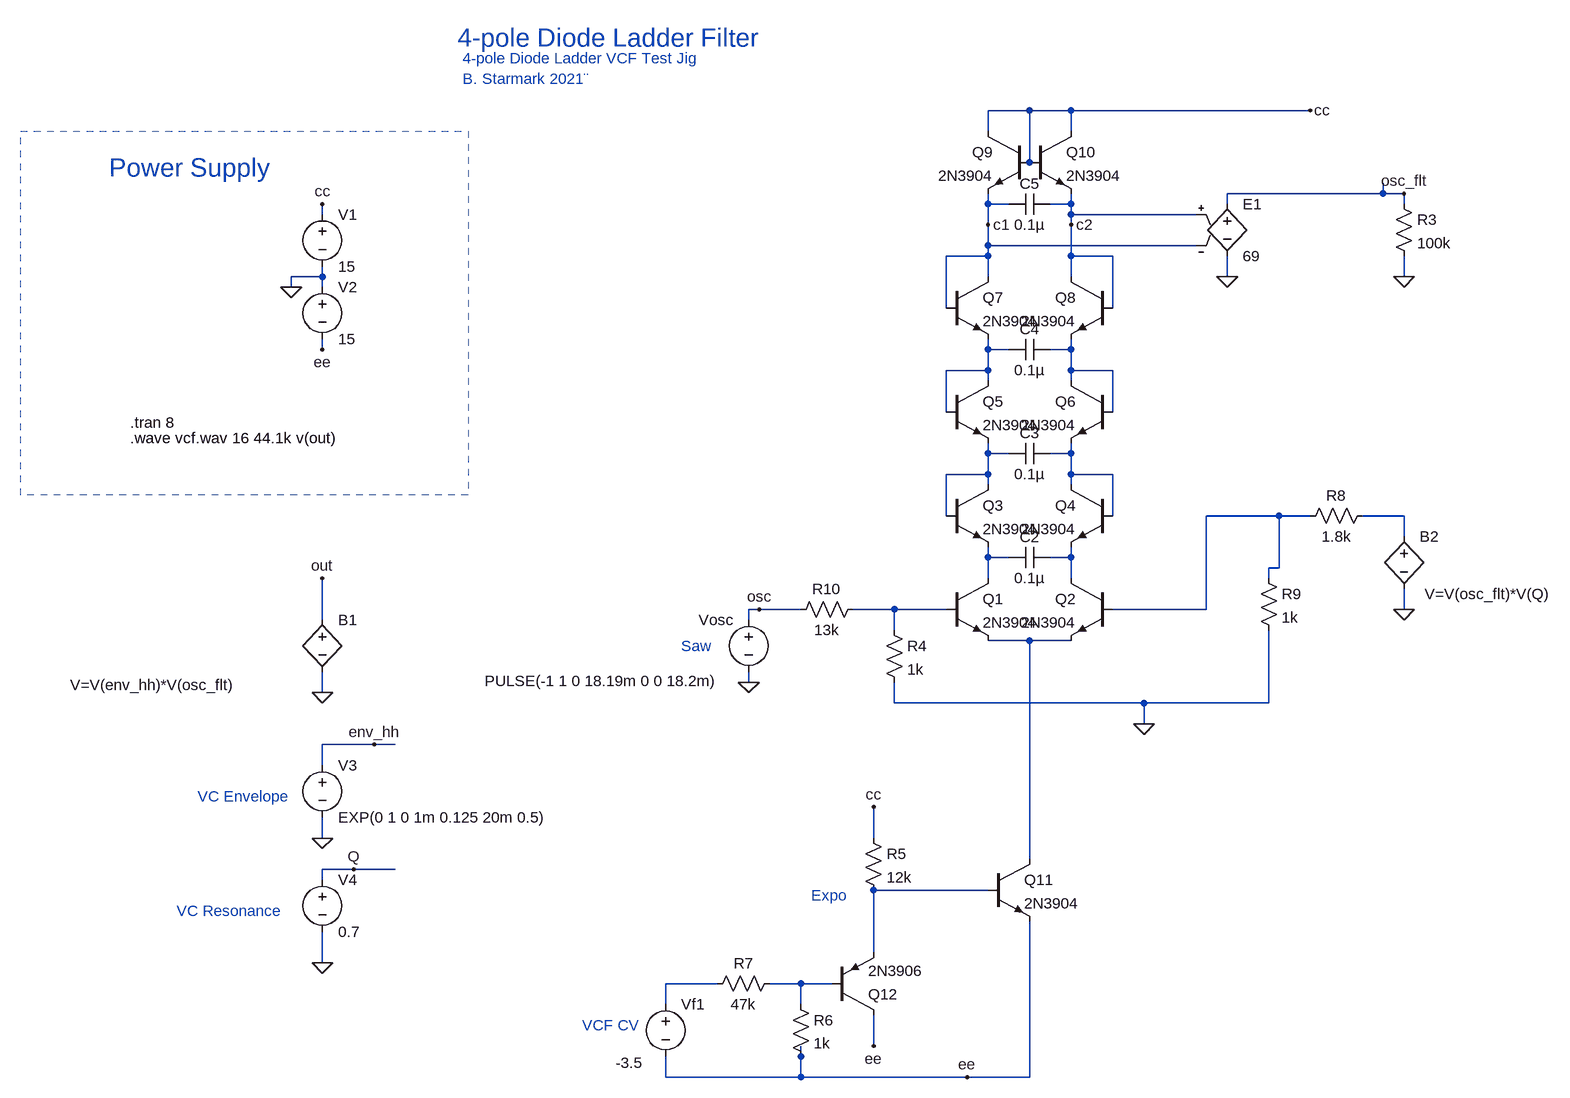
[diagram p0: schematic vcf.asc]
vcf.asc, the LTspice schematic file:
Version 4
SHEET 1 2688 1252
WIRE 1792 -352 1728 -352
WIRE 1856 -352 1792 -352
WIRE 2224 -352 1856 -352
WIRE 1728 -320 1728 -352
WIRE 1856 -320 1856 -352
WIRE 1792 -272 1792 -352
WIRE 2336 -224 2336 -240
WIRE 2336 -224 2096 -224
WIRE 2368 -224 2336 -224
WIRE 1728 -208 1728 -224
WIRE 1760 -208 1728 -208
WIRE 1856 -208 1856 -224
WIRE 1856 -208 1824 -208
WIRE 2096 -208 2096 -224
WIRE 2368 -208 2368 -224
WIRE 704 -192 704 -208
WIRE 1856 -192 1856 -208
WIRE 2048 -192 1856 -192
WIRE 1728 -176 1728 -208
WIRE 1856 -176 1856 -192
WIRE 1728 -144 1728 -176
WIRE 2048 -144 1728 -144
WIRE 1728 -128 1728 -144
WIRE 1728 -128 1664 -128
WIRE 1856 -128 1856 -176
WIRE 1920 -128 1856 -128
WIRE 704 -96 704 -112
WIRE 704 -96 656 -96
WIRE 1728 -96 1728 -128
WIRE 1856 -96 1856 -128
WIRE 2096 -96 2096 -128
WIRE 2368 -96 2368 -128
WIRE 656 -80 656 -96
WIRE 704 -80 704 -96
WIRE 1664 -48 1664 -128
WIRE 1920 -48 1920 -128
WIRE 704 16 704 0
WIRE 1728 16 1728 0
WIRE 1760 16 1728 16
WIRE 1856 16 1856 0
WIRE 1856 16 1824 16
WIRE 1728 48 1728 16
WIRE 1728 48 1664 48
WIRE 1856 48 1856 16
WIRE 1920 48 1856 48
WIRE 1728 64 1728 48
WIRE 1856 64 1856 48
WIRE 1664 112 1664 48
WIRE 1920 112 1920 48
WIRE 1728 176 1728 160
WIRE 1760 176 1728 176
WIRE 1856 176 1856 160
WIRE 1856 176 1824 176
WIRE 1728 208 1728 176
WIRE 1728 208 1664 208
WIRE 1856 208 1856 176
WIRE 1920 208 1856 208
WIRE 1728 224 1728 208
WIRE 1856 224 1856 208
WIRE 1664 272 1664 208
WIRE 1920 272 1920 208
WIRE 2176 272 2064 272
WIRE 2224 272 2176 272
WIRE 2368 272 2304 272
WIRE 2368 304 2368 272
WIRE 1728 336 1728 320
WIRE 1760 336 1728 336
WIRE 1856 336 1856 320
WIRE 1856 336 1824 336
WIRE 2176 352 2176 272
WIRE 2176 352 2160 352
WIRE 1728 368 1728 336
WIRE 1856 368 1856 336
WIRE 2160 368 2160 352
WIRE 1376 416 1360 416
WIRE 1440 416 1376 416
WIRE 1584 416 1520 416
WIRE 1664 416 1584 416
WIRE 2064 416 2064 272
WIRE 2064 416 1920 416
WIRE 2368 416 2368 384
WIRE 704 432 704 368
WIRE 1360 432 1360 416
WIRE 1584 448 1584 416
WIRE 1792 464 1728 464
WIRE 1856 464 1792 464
WIRE 1360 528 1360 512
WIRE 704 544 704 512
WIRE 1584 560 1584 528
WIRE 1968 560 1584 560
WIRE 2160 560 2160 448
WIRE 2160 560 1968 560
WIRE 1968 592 1968 560
WIRE 784 624 704 624
WIRE 816 624 784 624
WIRE 704 656 704 624
WIRE 704 768 704 736
WIRE 1552 768 1552 720
WIRE 1792 800 1792 464
WIRE 752 816 704 816
WIRE 816 816 752 816
WIRE 704 832 704 816
WIRE 1728 848 1552 848
WIRE 1552 944 1552 848
WIRE 704 960 704 912
WIRE 1312 992 1232 992
WIRE 1440 992 1392 992
WIRE 1488 992 1440 992
WIRE 1232 1024 1232 992
WIRE 1440 1024 1440 992
WIRE 1552 1088 1552 1040
WIRE 1440 1104 1440 1088
WIRE 1232 1136 1232 1104
WIRE 1440 1136 1440 1104
WIRE 1440 1136 1232 1136
WIRE 1696 1136 1440 1136
WIRE 1792 1136 1792 896
WIRE 1792 1136 1696 1136
FLAG 656 -80 0
FLAG 704 16 ee
FLAG 704 -208 cc
FLAG 704 368 out
FLAG 704 544 0
FLAG 2224 -352 cc
FLAG 2368 -96 0
FLAG 2096 -96 0
FLAG 1728 -176 c1
FLAG 1856 -176 c2
FLAG 1552 720 cc
FLAG 1552 1088 ee
FLAG 1696 1136 ee
FLAG 2368 -224 osc_flt
FLAG 1360 528 0
FLAG 704 768 0
FLAG 784 624 env_hh
FLAG 1376 416 osc
FLAG 1968 592 0
FLAG 2368 416 0
FLAG 704 960 0
FLAG 752 816 Q
SYMBOL voltage 704 -208 R0
SYMATTR InstName V1
SYMATTR Value 15
SYMBOL voltage 704 -96 R0
SYMATTR InstName V2
SYMATTR Value 15
SYMBOL bv 704 416 R0
WINDOW 3 -388 116 Left 2
SYMATTR Value V=V(env_hh)*V(osc_flt)
SYMATTR InstName B1
SYMBOL npn 1664 368 R0
SYMATTR InstName Q1
SYMATTR Value 2N3904
SYMBOL npn 1920 368 M0
SYMATTR InstName Q2
SYMATTR Value 2N3904
SYMBOL cap 1824 320 R90
WINDOW 0 0 32 VBottom 2
WINDOW 3 32 32 VTop 2
SYMATTR InstName C2
SYMATTR Value 0.1µ
SYMBOL npn 1664 224 R0
SYMATTR InstName Q3
SYMATTR Value 2N3904
SYMBOL npn 1920 224 M0
SYMATTR InstName Q4
SYMATTR Value 2N3904
SYMBOL cap 1824 160 R90
WINDOW 0 0 32 VBottom 2
WINDOW 3 32 32 VTop 2
SYMATTR InstName C3
SYMATTR Value 0.1µ
SYMBOL npn 1664 64 R0
SYMATTR InstName Q5
SYMATTR Value 2N3904
SYMBOL npn 1920 64 M0
SYMATTR InstName Q6
SYMATTR Value 2N3904
SYMBOL cap 1824 0 R90
WINDOW 0 0 32 VBottom 2
WINDOW 3 32 32 VTop 2
SYMATTR InstName C4
SYMATTR Value 0.1µ
SYMBOL npn 1664 -96 R0
SYMATTR InstName Q7
SYMATTR Value 2N3904
SYMBOL npn 1920 -96 M0
SYMATTR InstName Q8
SYMATTR Value 2N3904
SYMBOL cap 1824 -224 R90
WINDOW 0 0 32 VBottom 2
WINDOW 3 32 32 VTop 2
SYMATTR InstName C5
SYMATTR Value 0.1µ
SYMBOL npn 1792 -320 M0
SYMATTR InstName Q9
SYMATTR Value 2N3904
SYMBOL npn 1792 -320 R0
SYMATTR InstName Q10
SYMATTR Value 2N3904
SYMBOL res 2352 -224 R0
SYMATTR InstName R3
SYMATTR Value 100k
SYMBOL e 2096 -224 R0
SYMATTR InstName E1
SYMATTR Value 69
SYMBOL res 1568 432 R0
SYMATTR InstName R4
SYMATTR Value 1k
SYMBOL npn 1728 800 R0
SYMATTR InstName Q11
SYMATTR Value 2N3904
SYMBOL pnp 1488 1040 M180
SYMATTR InstName Q12
SYMATTR Value 2N3906
SYMBOL res 1536 752 R0
SYMATTR InstName R5
SYMATTR Value 12k
SYMBOL res 1424 1008 R0
SYMATTR InstName R6
SYMATTR Value 1k
SYMBOL res 1408 976 R90
WINDOW 0 0 56 VBottom 2
WINDOW 3 32 56 VTop 2
SYMATTR InstName R7
SYMATTR Value 47k
SYMBOL res 2320 256 R90
WINDOW 0 0 56 VBottom 2
WINDOW 3 32 56 VTop 2
SYMATTR InstName R8
SYMATTR Value 1.8k
SYMBOL res 2144 352 R0
SYMATTR InstName R9
SYMATTR Value 1k
SYMBOL voltage 1232 1008 R0
WINDOW 123 0 0 Left 0
WINDOW 39 0 0 Left 0
WINDOW 3 -77 106 Left 2
SYMATTR Value -3.5
SYMATTR InstName Vf1
SYMBOL res 1536 400 R90
WINDOW 0 0 56 VBottom 2
WINDOW 3 32 56 VTop 2
SYMATTR InstName R10
SYMATTR Value 13k
SYMBOL voltage 704 640 R0
WINDOW 123 0 0 Left 0
WINDOW 39 0 0 Left 0
SYMATTR InstName V3
SYMATTR Value EXP(0 1 0 1m 0.125 20m 0.5)
SYMBOL voltage 1360 416 M0
WINDOW 123 24 124 Left 2
WINDOW 39 0 0 Left 2
WINDOW 3 47 110 Left 2
SYMATTR Value PULSE(-1 1 0 18.19m 0 0 18.2m)
SYMATTR InstName Vosc
SYMBOL bv 2368 288 R0
WINDOW 3 32 104 Left 2
SYMATTR Value V=V(osc_flt)*V(Q)
SYMATTR InstName B2
SYMBOL voltage 704 816 R0
WINDOW 123 0 0 Left 0
WINDOW 39 0 0 Left 0
SYMATTR InstName V4
SYMATTR Value 0.7
TEXT 408 128 Left 2 !.tran 8
TEXT 376 -264 Left 4 ;Power Supply
TEXT 1456 856 Left 2 ;Expo
TEXT 1104 1056 Left 2 ;VCF CV
TEXT 408 152 Left 2 !.wave vcf.wav 16 44.1k v(out)
TEXT 912 -464 Left 4 ;4-pole Diode Ladder Filter
TEXT 920 -432 Left 2 ;4-pole Diode Ladder VCF Test Jig\nB. Starmark 2021¨
TEXT 1256 472 Left 2 ;Saw
TEXT 480 880 Left 2 ;VC Resonance
TEXT 512 704 Left 2 ;VC Envelope
RECTANGLE Normal 928 240 240 -320 2

The netlist it stands for:
* vcf.asc
V1 cc 0 15
V2 0 ee 15
B1 out 0 V=V(env_hh)*V(osc_flt)
Q1 N007 N009 N010 0 2N3904
Q2 N008 N005 N010 0 2N3904
C2 N008 N007 0.1µ
Q3 N003 N003 N007 0 2N3904
Q4 N004 N004 N008 0 2N3904
C3 N004 N003 0.1µ
Q5 N001 N001 N003 0 2N3904
Q6 N002 N002 N004 0 2N3904
C4 N002 N001 0.1µ
Q7 c1 c1 N001 0 2N3904
Q8 c2 c2 N002 0 2N3904
C5 c2 c1 0.1µ
Q9 cc cc c1 0 2N3904
Q10 cc cc c2 0 2N3904
R3 osc_flt 0 100k
E1 osc_flt 0 c2 c1 69
R4 N009 0 1k
Q11 N010 N011 ee 0 2N3904
Q12 ee N013 N011 0 2N3906
R5 cc N011 12k
R6 N013 ee 1k
R7 N013 N012 47k
R8 N006 N005 1.8k
R9 N005 0 1k
Vf1 N012 ee -3.5
R10 N009 osc 13k
V3 env_hh 0 EXP(0 1 0 1m 0.125 20m 0.5)
Vosc osc 0 PULSE(-1 1 0 18.19m 0 0 18.2m)
B2 N006 0 V=V(osc_flt)*V(Q)
V4 Q 0 0.7
.model NPN NPN
.model PNP PNP
.lib standard.bjt
.tran 8
* Power Supply
* Expo
* VCF CV
.wave vcf.wav 16 44.1k v(out)
* 4-pole Diode Ladder Filter
* 4-pole Diode Ladder VCF Test Jig
* B. Starmark 2021¨
* Saw
* VC Resonance
* VC Envelope
.backanno
.end